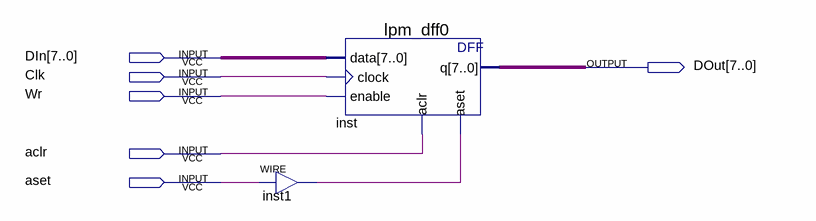
[diagram p0: schematic sheet]
// Quartus schematic Pro1_1.bdf as structural Verilog: 2 symbols, 6 pins
module Pro1_1 (
  input  [7:0] DIn,
  input  Clk,
  input  Wr,
  input  aclr,
  input  aset,
  output [7:0] DOut
);

  wire inst1_out;

  assign inst1_out = aset;  // WIRE inst1
  lpm_dff0 inst (.data(DIn), .clock(Clk), .enable(Wr), .aclr(aclr), .aset(inst1_out), .q(DOut));
endmodule
